# Altium schematic sheet steppers.SchDoc: Steppers
size 431 x 279 mm; Author: Shivam Sharma; SheetNumber: 11; SheetTotal: 13; SheetRevision: 1.0
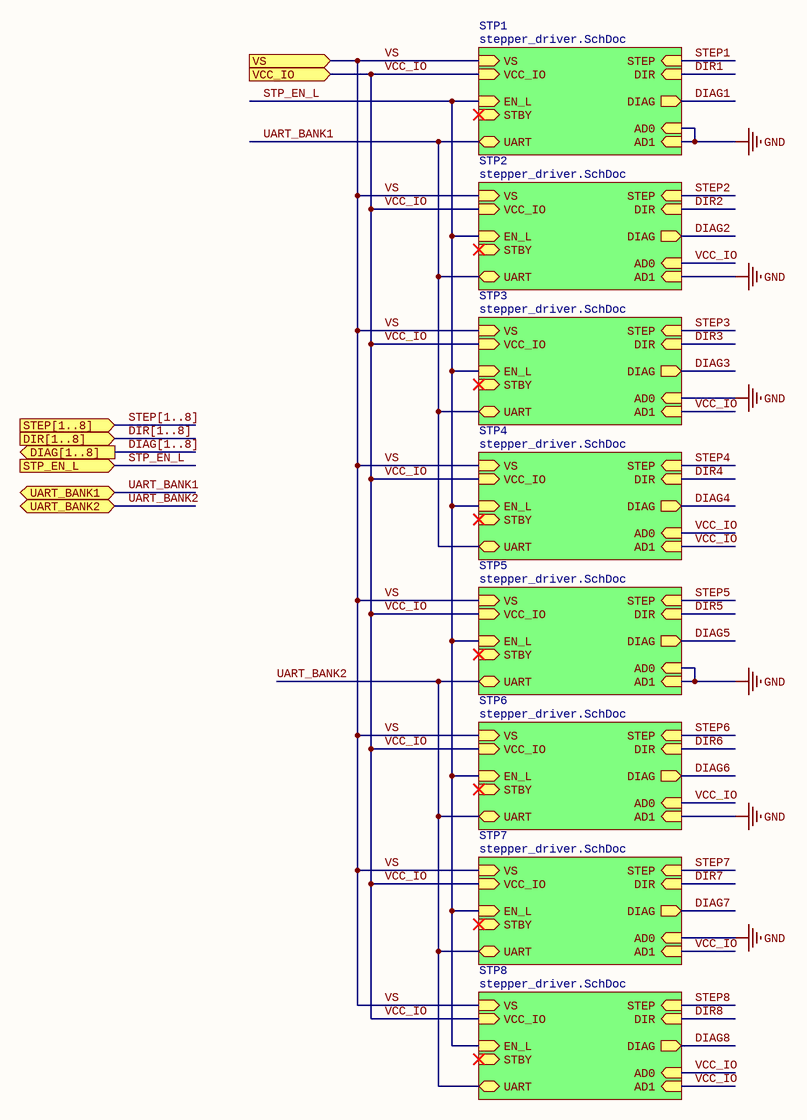
[diagram p0: steppers.SchDoc]

## Sub-sheets
STP1 = stepper_driver.SchDoc: VS (in), VCC_IO (in), STBY (in), EN_L (in), UART (bidir), DIR (in), STEP (in), AD0 (in), AD1 (in), DIAG (out)
STP2 = stepper_driver.SchDoc: VS (in), VCC_IO (in), STBY (in), EN_L (in), UART (bidir), DIR (in), STEP (in), AD0 (in), AD1 (in), DIAG (out)
STP3 = stepper_driver.SchDoc: VS (in), VCC_IO (in), STBY (in), EN_L (in), UART (bidir), DIR (in), STEP (in), AD0 (in), AD1 (in), DIAG (out)
STP4 = stepper_driver.SchDoc: VS (in), VCC_IO (in), STBY (in), EN_L (in), UART (bidir), DIR (in), STEP (in), AD0 (in), AD1 (in), DIAG (out)
STP5 = stepper_driver.SchDoc: VS (in), VCC_IO (in), STBY (in), EN_L (in), UART (bidir), DIR (in), STEP (in), AD0 (in), AD1 (in), DIAG (out)
STP6 = stepper_driver.SchDoc: VS (in), VCC_IO (in), STBY (in), EN_L (in), UART (bidir), DIR (in), STEP (in), AD0 (in), AD1 (in), DIAG (out)
STP7 = stepper_driver.SchDoc: VS (in), VCC_IO (in), STBY (in), EN_L (in), UART (bidir), DIR (in), STEP (in), AD0 (in), AD1 (in), DIAG (out)
STP8 = stepper_driver.SchDoc: VS (in), VCC_IO (in), STBY (in), EN_L (in), UART (bidir), DIR (in), STEP (in), AD0 (in), AD1 (in), DIAG (out)

## Ports
DIAG[1..8] (out), DIR[1..8] (in), STEP[1..8] (in), STP_EN_L (in), UART_BANK1 (bidir), UART_BANK2 (bidir), VCC_IO (in), VS (in)

## Nets
GND: sheet STP1/AD0, sheet STP1/AD1, sheet STP2/AD1, sheet STP3/AD0, sheet STP5/AD0, sheet STP5/AD1, sheet STP6/AD1, sheet STP7/AD0
DIAG1: sheet STP1/DIAG
DIAG2: sheet STP2/DIAG
DIAG3: sheet STP3/DIAG
DIAG4: sheet STP4/DIAG
DIAG5: sheet STP5/DIAG
DIAG6: sheet STP6/DIAG
DIAG7: sheet STP7/DIAG
DIAG8: sheet STP8/DIAG
DIR1: sheet STP1/DIR
DIR2: sheet STP2/DIR
DIR3: sheet STP3/DIR
DIR4: sheet STP4/DIR
DIR5: sheet STP5/DIR
DIR6: sheet STP6/DIR
DIR7: sheet STP7/DIR
DIR8: sheet STP8/DIR
STEP1: sheet STP1/STEP
STEP2: sheet STP2/STEP
STEP3: sheet STP3/STEP
STEP4: sheet STP4/STEP
STEP5: sheet STP5/STEP
STEP6: sheet STP6/STEP
STEP7: sheet STP7/STEP
STEP8: sheet STP8/STEP
STP_EN_L: port STP_EN_L, sheet STP1/EN_L, sheet STP2/EN_L, sheet STP3/EN_L, sheet STP4/EN_L, sheet STP5/EN_L, sheet STP6/EN_L, sheet STP7/EN_L, sheet STP8/EN_L
UART_BANK1: port UART_BANK1, sheet STP1/UART, sheet STP2/UART, sheet STP3/UART, sheet STP4/UART
UART_BANK2: port UART_BANK2, sheet STP5/UART, sheet STP6/UART, sheet STP7/UART, sheet STP8/UART
VCC_IO: port VCC_IO, sheet STP1/VCC_IO, sheet STP2/VCC_IO, sheet STP2/AD0, sheet STP3/VCC_IO, sheet STP3/AD1, sheet STP4/VCC_IO, sheet STP4/AD0, sheet STP4/AD1, sheet STP5/VCC_IO, sheet STP6/VCC_IO, sheet STP6/AD0, sheet STP7/VCC_IO, sheet STP7/AD1, sheet STP8/VCC_IO, sheet STP8/AD0, sheet STP8/AD1
VS: port VS, sheet STP1/VS, sheet STP2/VS, sheet STP3/VS, sheet STP4/VS, sheet STP5/VS, sheet STP6/VS, sheet STP7/VS, sheet STP8/VS

## Buses and harness runs
bus DIAG[1..8] = port DIAG[1..8]
bus DIR[1..8] = port DIR[1..8]
bus STEP[1..8] = port STEP[1..8]

## Notes on the sheet
- Title:
- Author:
- Approved:
- Size:
- Date:
- Git Hash:
- Sch Revision:
- B
- Prj:
- Sheet Revision:
- Variant:
- Edited:
- CONFIDENTIAL
- File: